# EasyEDA Pro project ProPrj_Final Main_2026-01-12.epro, board PCB2
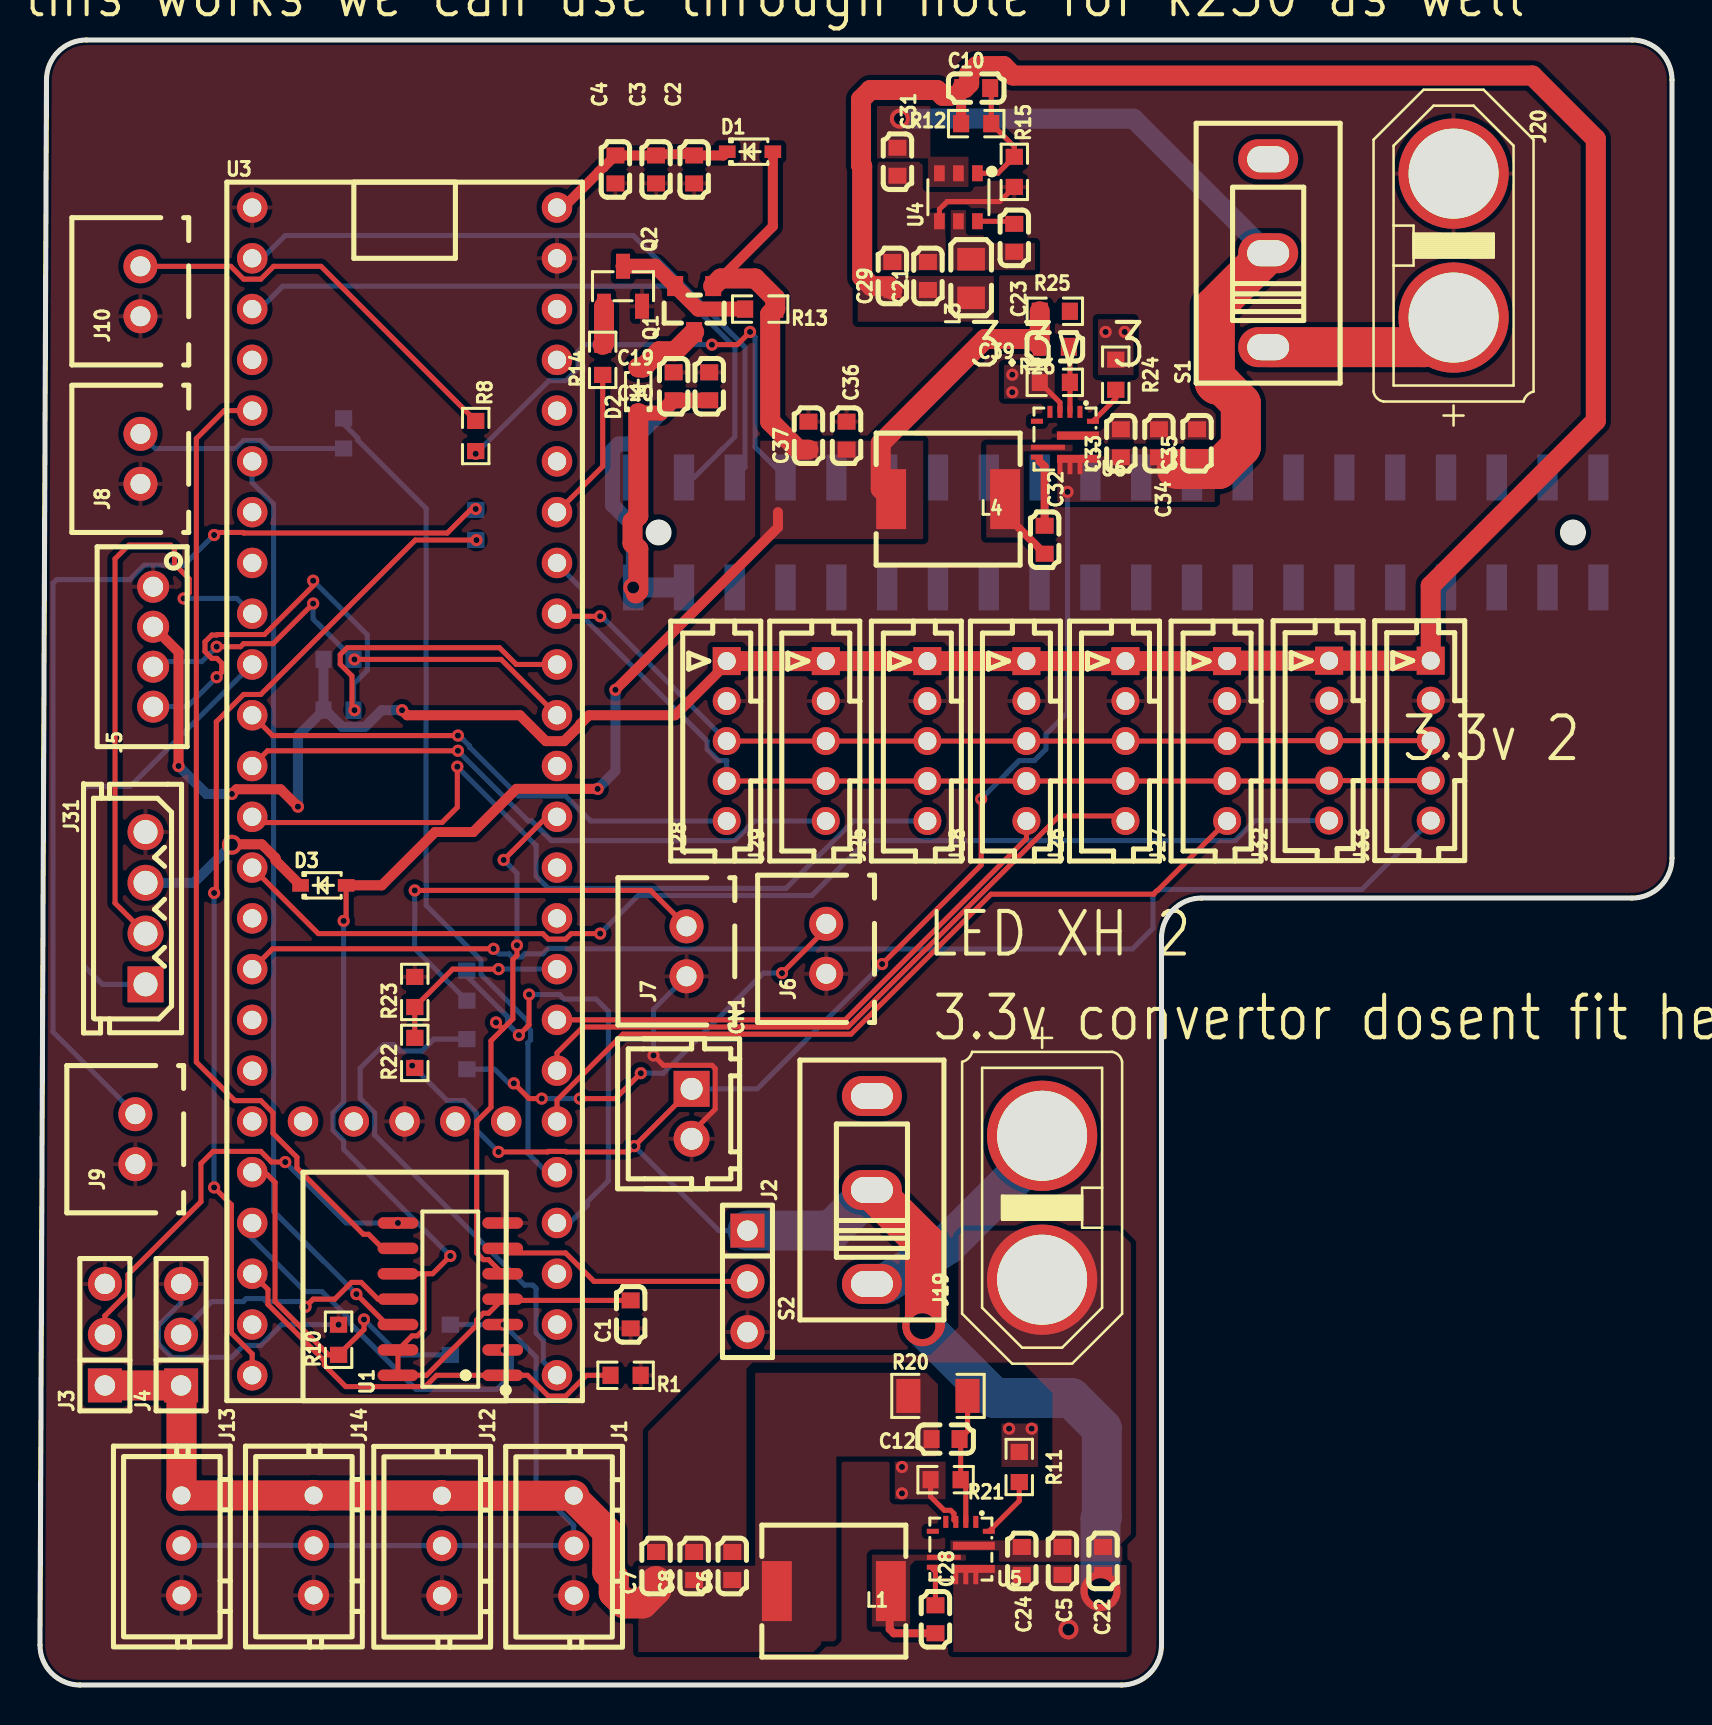
[diagram p1: board, top side]
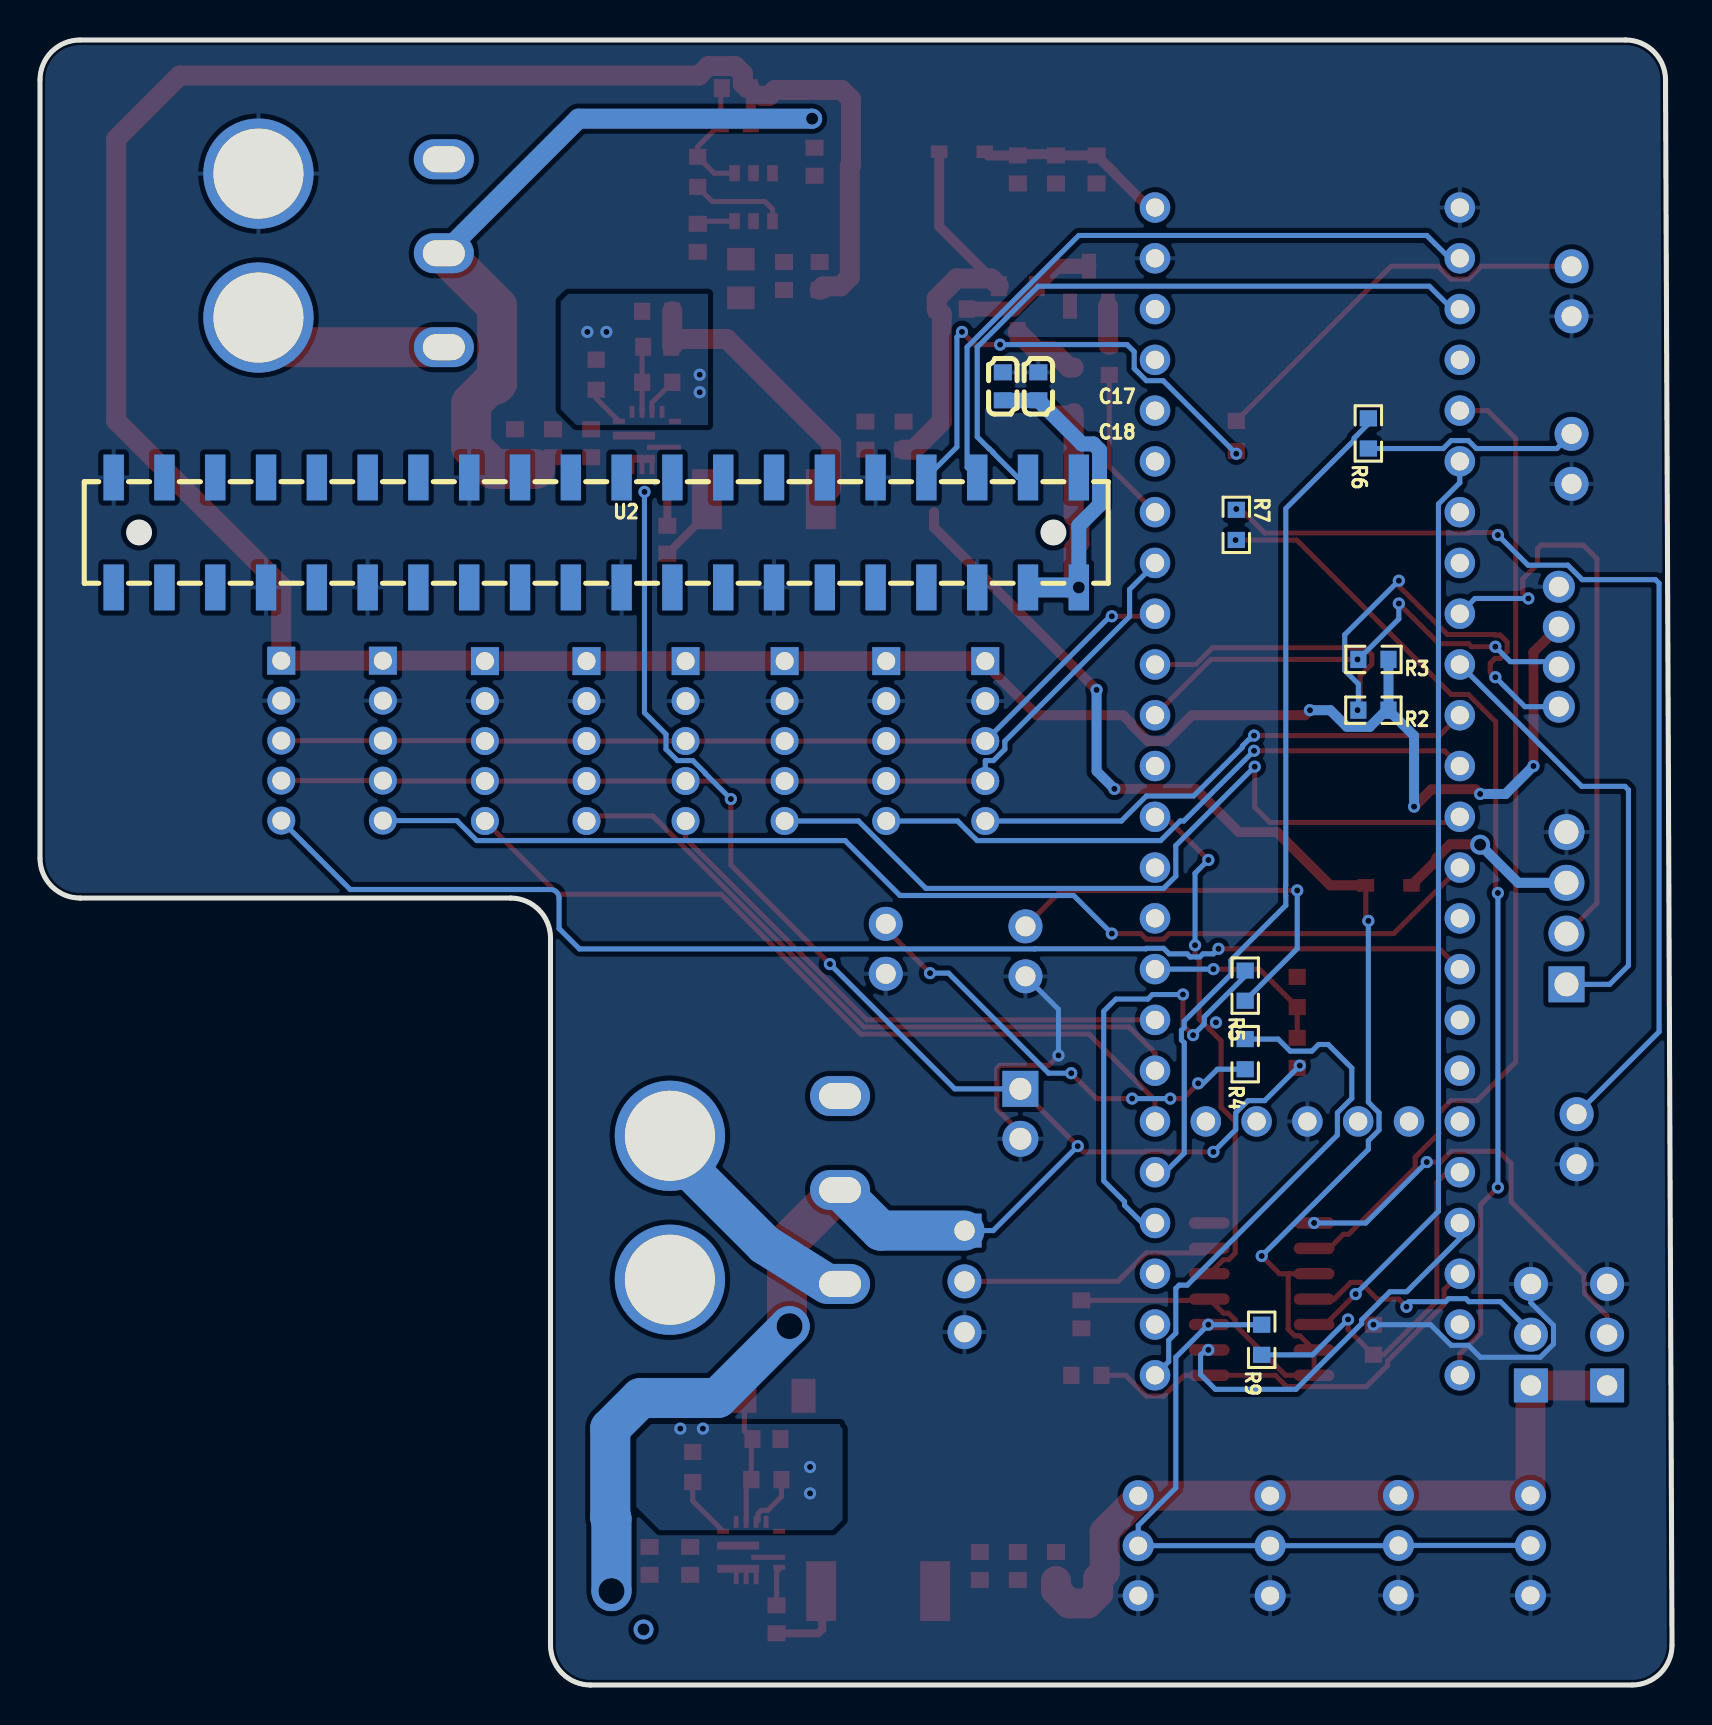
[diagram p2: board, bottom side, seen from below]

Outline 81.6 x 82.3 mm; copper layers: Top Layer, Bottom Layer. Coordinates in mm from the lower left corner of the outline.
Outline path: 0,2.01 0.32,80.3 arc(0.91,81.71) 2.32,82.3 79.6,82.3 arc(81.02,81.71) 81.6,80.3 81.6,41.37 arc(81.02,39.96) 79.6,39.37 58.08,39.37 arc(56.66,38.78) 56.08,37.37 56.08,2 arc(55.49,0.59) 54.08,0 2,0 arc(0.58,0.59) 0,2.01
Stack: Top Layer 0.035mm / Dielectric1 1.51mm FR4 er 4.5 / Bottom Layer 0.035mm

## Design rules (mm)
template: JLCPCB Capability(Two Layers Board)
spacing copperThickness1oz (default): track to track 0.102, other pairs 0.152 to 0.3
spacing copperThickness2oz: track to track 0.203, other pairs 0.152 to 0.3
track width copperThickness1oz (default): min 0.127, default 0.254, max 2.54
track width copperThickness2oz: min 0.203, default 0.254, max 2.54
differential pair differentialPair (default): width min 0.127, default 0.254, max 2.54; gap min 0.152, default 0.152
via viaSize (default): diameter min 0.5, default 0.61, max 10; hole min 0.3, default 0.305, max 6.3

## Placement (name value [footprint] x y rotation side)
C1  100nF  [C0603]  29.53 18.54 90 top
C2  22uF  [C0603]  32.71 75.82 270 top
C3  1uF  [C0603]  30.8 75.82 270 top
C4  100nF  [C0603]  28.77 75.82 270 top
C5  10uF  [C0603]  51.12 6.21 90 top
C6  22uF  [C0603]  34.61 5.95 90 top
C7  22uF  [C0603]  30.8 5.95 90 top
C8  22uF  [C0603]  32.71 5.95 90 top
C10  100pF  [C0603]  46.81 79.89 0 top
C12  150pF  [C0603]  45.28 12.3 0 top
C17  100nF  [C0603]  31.68 64.97 90 bottom
C18  1uF  [C0603]  33.46 64.97 90 bottom
C19  22uF  [C0603]  31.68 64.97 90 top
C20  47uF  [C0603]  33.46 64.97 90 top
C21  22uF  [C0603]  44.4 70.49 90 top
C22  10uF  [C0603]  53.16 6.21 90 top
C23  100nF  [C0603]  48.72 72.4 90 top
C24  100nF  [C0603]  49.09 6.21 90 top
C28  100nF  [C0603]  44.77 3.29 270 top
C29  22uF  [C0603]  42.62 70.49 90 top
C31  10uF  [C0603]  42.88 76.21 270 top
C32  100nF  [C0603]  50.23 57.3 270 top
C33  100nF  [C0603]  54.04 62.12 90 top
C34  10uF  [C0603]  55.95 62.12 90 top
C35  10uF  [C0603]  57.85 62.12 90 top
C36  22uF  [C0603]  40.33 62.5 90 top
C37  22uF  [C0603]  38.42 62.5 90 top
C39  150pF  [C0603]  50.74 66.95 0 top
CN1  ZX-XH2.54-2PZZ  [CONN-TH_2P-P2.50_HX25003-2A]  32.58 28.58 270 top
D1  BAT60B  [SOD-323_L1.7-W1.3-LS2.6-RD-1]  35.5 76.71 0 top
D2  BAT60B  [SOD-323_L1.7-W1.3-LS2.6-RD-1]  29.91 64.77 90 top
D3  BAT60B  [SOD-323_L1.7-W1.3-LS2.6-RD-1]  14.17 40.01 0 top
J1  B3B-XH-A(LF)(SN)  [CONN-TH_3P-P2.50_A2501WV2-3P]  26.69 6.97 270 top
J2  PZ254V-11-03P  [HDR-TH_3P-P2.54-V-M_PZ254V-11-03P]  35.38 20.19 270 top
J3  PZ254V-11-03P  [HDR-TH_3P-P2.54-V-M_PZ254V-11-03P]  3.24 17.53 90 top
J4  PZ254V-11-03P  [HDR-TH_3P-P2.54-V-M_PZ254V-11-03P]  7.05 17.53 90 top
J5  B4B-PH-K-S(LF)(SN)  [CONN-TH_B4B-PH-K-S]  5.66 51.94 90 top
J6  B2B-XH-A(LF)(SN)  [CONN-TH_B2B-XH-A-LF-SN]  39.31 36.83 90 top
J7  B2B-XH-A(LF)(SN)  [CONN-TH_B2B-XH-A-LF-SN]  32.33 36.7 90 top
J8  B2B-XH-A(LF)(SN)  [CONN-TH_B2B-XH-A-LF-SN]  5.02 61.34 90 top
J9  B2B-XH-A(LF)(SN)  [CONN-TH_B2B-XH-A-LF-SN]  4.77 27.31 90 top
J10  B2B-XH-A(LF)(SN)  [CONN-TH_B2B-XH-A-LF-SN]  5.02 69.72 90 top
J12  B3B-XH-A(LF)(SN)  [CONN-TH_3P-P2.50_A2501WV2-3P]  20.09 6.97 270 top
J13  B3B-XH-A(LF)(SN)  [CONN-TH_3P-P2.50_A2501WV2-3P]  7.08 6.98 270 top
J14  B3B-XH-A(LF)(SN)  [CONN-TH_3P-P2.50_A2501WV2-3P]  13.68 6.98 270 top
J18  B5B-PH-K-S(LF)(SN)  [CONN-TH_B5B-PH-K-S-LF-SN]  49.32 47.22 90 top
J19  XT60-F  [CONN-TH_XT60PB-F]  50.11 23.88 90 top
J20  XT60-F  [CONN-TH_XT60PB-F]  70.68 72.01 270 top
J25  B5B-PH-K-S(LF)(SN)  [CONN-TH_B5B-PH-K-S-LF-SN]  44.37 47.22 90 top
J26  B5B-PH-K-S(LF)(SN)  [CONN-TH_B5B-PH-K-S-LF-SN]  54.28 47.22 90 top
J27  B5B-PH-K-S(LF)(SN)  [CONN-TH_B5B-PH-K-S-LF-SN]  59.36 47.22 90 top
J28  B5B-PH-K-S(LF)(SN)  [CONN-TH_B5B-PH-K-S-LF-SN]  34.34 47.22 90 top
J29  B5B-PH-K-S(LF)(SN)  [CONN-TH_B5B-PH-K-S-LF-SN]  39.29 47.22 90 top
J31  22035045  [CONN-TH_22035045]  5.28 38.86 270 top
J32  B5B-PH-K-S(LF)(SN)  [CONN-TH_B5B-PH-K-S-LF-SN]  64.46 47.24 90 top
J33  B5B-PH-K-S(LF)(SN)  [CONN-TH_B5B-PH-K-S-LF-SN]  69.54 47.24 90 top
L1  3.3uH  [IND-SMD_CYA0650-3.3UH]  39.69 4.7 180 top
L3  6.8uH  [L0805]  46.56 70.36 270 top
L4  3.3uH  [IND-SMD_CYA0650-3.3UH]  45.41 59.33 180 top
Q1  AO3401A  [SOT-23_L2.9-W1.3-P1.90-LS2.4-BR]  32.71 68.83 90 top
Q2  SS8050(RANGE:200-350)  [SOT-23-3_L2.9-W1.3-P1.90-LS2.4-BR]  29.15 69.98 270 top
R1  10kΩ  [R0603]  29.28 15.49 180 top
R2  4.7kΩ  [R0603]  14.93 48.77 0 bottom
R3  4.7kΩ  [R0603]  14.93 51.31 0 bottom
R4  470Ω  [R0603]  21.34 31.56 90 bottom
R5  470Ω  [R0603]  21.34 34.99 90 bottom
R6  470Ω  [R0603]  15.18 62.61 90 bottom
R7  470Ω  [R0603]  21.79 58.04 270 bottom
R8  1kΩ  [R0603]  21.79 62.48 270 top
R9  2.2kΩ  [R0603]  20.52 17.27 90 bottom
R10  2.2kΩ  [R0603]  14.93 17.27 90 top
R11  52.3kΩ  [R0603]  48.97 10.91 90 top
R12  196kΩ  [R0603]  46.81 78.11 0 top
R13  1kΩ  [R0603]  36.01 68.83 180 top
R14  1kΩ  [R0603]  28.14 66.29 90 top
R15  62kΩ  [R0603]  48.72 75.7 270 top
R20  90kΩ  [R1206]  44.9 14.46 0 top
R21  10kΩ  [R0603]  45.28 10.27 180 top
R22  80kΩ  [R0603]  18.74 31.62 90 top
R23  20kΩ  [R0603]  18.74 34.67 90 top
R24  52.3kΩ  [R0603]  53.79 65.55 90 top
R25  73.2kΩ  [R0603]  50.74 68.73 0 top
R26  10kΩ  [R0603]  50.74 65.17 180 top
S1  SS-12M11G4  [SW-TH_XKB_SS-12M11XX]  61.41 71.63 90 top
S2  SS-12M11G4  [SW-TH_XKB_SS-12M11XX]  41.6 24.77 90 top
U1  DM74LS126AM  [SOIC-14_L8.7-W3.9-P1.27-LS6.0-BL]  20.52 19.3 90 top
U2  FH-00148  [HDR-SMD_40P-P2.54-V-F-R2-C20-S7.1-EH]  53.79 57.66 0 bottom
U3  -  [TEENSY 4.1]  18.23 43.56 0 top
U4  AP63201WU-7  [TSOT-23-6_L2.9-W1.6-P0.95-LS2.8-BR]  45.92 74.43 90 top
U5  TPS56A37RPAR  [VQFN-HR-10_L3.0-W3.0_TI_RPA]  46.04 6.84 180 top
U6  TPS56A37RPAR  [VQFN-HR-10_L3.0-W3.0_TI_RPA]  51.25 62.38 180 top

## Footprints (pads in the part's own frame, mm; a bottom-side part is the same pattern mirrored in y, then rotated)
C0603
  rect 0.8x0.9 smd: 1(-0.7,0) 2(0.7,0)
CONN-TH_2P-P2.50_HX25003-2A
  rect 1.8x1.8 hole 1.1: 1(-1.25,0)
  round 1.8 hole 1.1: 2(1.25,0)
CONN-TH_3P-P2.50_A2501WV2-3P
  round 1.55 hole 0.9: 1(-2.5,0) 2(0,0) 3(2.5,0)
CONN-TH_22035045
  rect 1.8x1.8 hole 1.2: 1(3.81,0)
  round 1.8 hole 1.2: 2(1.27,0) 3(-1.27,0) 4(-3.81,0)
CONN-TH_B2B-XH-A-LF-SN
  round 1.7 hole 1: 1(1.25,0) 2(-1.25,0)
CONN-TH_B4B-PH-K-S
  round 1.6 hole 1: 1(3,0) 2(1,0) 3(-1,0) 4(-3,0)
CONN-TH_B5B-PH-K-S-LF-SN
  rect 1.4x1.4 hole 0.9: 1(4,0)
  round 1.4 hole 0.9: 2(2,0) 3(0,0) 4(-2,0) 5(-4,0)
CONN-TH_XT60PB-F
  round 5.516 hole 4.505x4.5: +(3.6,0) -(-3.6,0)
HDR-SMD_40P-P2.54-V-F-R2-C20-S7.1-EH
  rect 1.02x2.3 smd: 1(-24.13,-2.75) 2(-24.13,2.75) 3(-21.59,-2.75) 4(-21.59,2.75) 5(-19.05,-2.75) 6(-19.05,2.75) 7(-16.51,-2.75) 8(-16.51,2.75) 9(-13.97,-2.75) 10(-13.97,2.75) 11(-11.43,-2.75) 12(-11.43,2.75) 13(-8.89,-2.75) 14(-8.89,2.75) 15(-6.35,-2.75) 16(-6.35,2.75) 17(-3.81,-2.75) 18(-3.81,2.75) 19(-1.27,-2.75) 20(-1.27,2.75) 21(1.27,-2.75) 22(1.27,2.75) 23(3.81,-2.75) 24(3.81,2.75) 25(6.35,-2.75) 26(6.35,2.75) 27(8.89,-2.75) 28(8.89,2.75) 29(11.43,-2.75) 30(11.43,2.75) 31(13.97,-2.75) 32(13.97,2.75) 33(16.51,-2.75) 34(16.51,2.75) 35(19.05,-2.75) 36(19.05,2.75) 37(21.59,-2.75) 38(21.59,2.75) 39(24.13,-2.75) 40(24.13,2.75)
HDR-TH_3P-P2.54-V-M_PZ254V-11-03P
  rect 1.7x1.7 hole 1.02: 1(-2.54,0)
  round 1.7 hole 1.02: 2(0,0) 3(2.54,0)
IND-SMD_CYA0650-3.3UH
  rect 1.5x3 smd: 1(-2.85,0) 2(2.85,0)
L0805
  rect 1.133x1.377 smd: 1(-0.966,0) 2(0.966,0)
R0603
  rect 0.806x0.864 smd: 1(-0.753,0) 2(0.753,0)
R1206
  rect 1.208x1.701 smd: 1(-1.479,0) 2(1.479,0)
SOD-323_L1.7-W1.3-LS2.6-RD-1
  rect 0.83x0.63 smd: 1(-1.14,0) 2(1.14,0)
SOIC-14_L8.7-W3.9-P1.27-LS6.0-BL
  oval 0.574x2.038 smd: 1(-3.81,-2.619) 2(-2.54,-2.619) 3(-1.27,-2.619) 4(0,-2.619) 5(1.27,-2.619) 6(2.54,-2.619) 7(3.81,-2.619) 8(3.81,2.619) 9(2.54,2.619) 10(1.27,2.619) 11(0,2.619) 12(-1.27,2.619) 13(-2.54,2.619) 14(-3.81,2.619)
SOT-23-3_L2.9-W1.3-P1.90-LS2.4-BR
  rect 1.25x0.7 smd: 1(1,-0.95) 2(1,0.95) 3(-1,0)
SOT-23_L2.9-W1.3-P1.90-LS2.4-BR
  rect 1x0.8 smd: 1(1.15,-0.95) 2(1.15,0.95) 3(-1.15,0)
SW-TH_XKB_SS-12M11XX
  oval 2x3 hole 1.3x2.1: 1(-4.7,0) 2(0,0) 3(4.7,0)
TEENSY 4.1
  round 1.524 hole 0.914: 1(-7.62,30.353) 2(-7.62,27.813) 3(-7.62,25.273) 4(-7.62,22.733) 5(-7.62,20.193) 6(-7.62,17.653) 7(-7.62,15.113) 8(-7.62,12.573) 9(-7.62,10.033) 10(-7.62,7.493) 11(-7.62,4.953) 12(-7.62,2.413) 13(-7.62,-0.127) 14(-7.62,-2.667) 15(-7.62,-5.207) 16(-7.62,-7.747) 17(-7.62,-10.287) 18(-7.62,-12.827) 19(-7.62,-15.367) 20(-7.62,-17.907) 21(-7.62,-20.447) 22(-7.62,-22.987) 23(-7.62,-25.527) 24(-7.62,-28.067) 25(7.62,30.353) 26(7.62,27.813) 27(7.62,25.273) 28(7.62,22.733) 29(7.62,20.193) 30(7.62,17.653) 31(7.62,15.113) 32(7.62,12.573) 33(7.62,10.033) 34(7.62,7.493) 35(7.62,4.953) 36(7.62,2.413) 37(7.62,-0.127) 38(7.62,-2.667) 39(7.62,-5.207) 40(7.62,-7.747) 41(7.62,-10.287) 42(7.62,-12.827) 43(7.62,-15.367) 44(7.62,-17.907) 45(7.62,-20.447) 46(7.62,-22.987) 47(7.62,-25.527) 48(7.62,-28.067) 49(5.08,-15.367) 50(2.54,-15.367) 51(0,-15.367) 52(-2.54,-15.367) 53(-5.08,-15.367)
TSOT-23-6_L2.9-W1.6-P0.95-LS2.8-BR
  rect 0.8x0.532 smd: 1(1.2,-0.95) 2(1.2,0) 3(1.2,0.95) 4(-1.2,0.95) 5(-1.2,0) 6(-1.2,-0.95)
VQFN-HR-10_L3.0-W3.0_TI_RPA
  rect 0.25x0.6 smd: 1(-0.75,-1.317) 2(-0.25,-1.317) 3(0.25,-1.317) 4(0.75,-1.317)
  rect 0.6x0.25 smd: 5(1.4,-0.848) 7(1.4,0.953) 10(-1.4,-0.848)
  rect 1.7x0.25 smd: 6(0.85,0.453)
  custom 2.1x0.97 smd: 8(-0.65,1.317)
  rect 2.1x0.4 smd: 9(-0.65,-0.128)

## Nets
As in the schematic.

Pads without a net: S1 3; S2 3; U2 1 8 10 11 12 13 15 16 17 18 19 21 22 23 24 26 27 28 29 31 32 33 35 36 37 38 40; U3 4 7 8 15 17 18 19 23 27 28 29 30 36 38 39 46 47 49 50 52 53; U5 1 4 5; U6 1 4 5

## Via types
v1: diameter 1, hole 0.6, Top Layer to Bottom Layer, 4 vias
v2: diameter 0.61, hole 0.305, Top Layer to Bottom Layer, 64 vias
v3: diameter 2, hole 1.3, Top Layer to Bottom Layer, 2 vias

## Routing (per net, layer and track width the routed paths; a pad name or vN(x,y) marks a point on that pad's centre or on a via; arc(x,y) is an arc through that point)
+3.3V: length 161.3
  Top Layer w0.5: v2(9.59,44.58) 9.83,44.81 12.03,44.81 v2(12.9,43.94) ; v2(6.93,45.97) 6.93,51.67 J5.2 ; v2(18.1,48.77) 18.36,48.51 24,48.51 25.29,47.22 26.2,47.22 27.01,48.03 27.01,48.08 27.45,48.51 31.76,48.51 34.34,51.1 J28.1 ; R12.1 46.06,79.84
  Top Layer w1: C29.1 42.44,69.97 41.58,69.97 41.11,70.44 41.11,75.98 41.05,76.04 41.05,79.33 41.52,79.79 44.85,79.79 45.14,79.5 45.54,79.5 ; C10.1 46.23,79.89 46.46,80.12 46.46,80.61 46.84,80.99 48.18,80.99 48.65,80.52 74.62,80.52 77.79,77.34 77.79,63.25 69.54,54.99 J33.1 J32.1 59.38,51.24 J27.1 J26.1 J18.1 J25.1 J29.1 J28.1
  Bottom Layer w0.5: v2(9.59,44.58) 8.32,44.58 v2(6.93,45.97) ; R2.1 R3.1 ; R2.1 14.28,48.77 15.11,47.93 16.25,47.93 17.09,48.77 v2(18.1,48.77) ; R2.1 12.9,47.49 12.9,44.2
+5V: length 110.4
  Top Layer w0.254: 19.12,20.57 19.2,20.5 19.2,17.8 18.86,17.47 18.6,17.47 U1.13 U1.14 19.33,15.49 21.84,18.01 21.84,18.27 22.17,18.6 22.43,18.6 U1.4 23.2,19.24 C1.2 ; 19.12,20.57 U1.10 ; 19.12,20.57 19.63,20.57 v2(20.52,21.46) ; v2(15.18,38.23) 15.31,38.35 D3.2
  Top Layer w0.5: 34.04,70.37 36.64,72.97 D1.2 ; v2(28.77,49.78) 36.9,57.91 36.9,58.67 ; v2(27.88,44.83) 23.82,44.83 21.66,42.67 19.75,42.67 17.09,40.01 D3.2
  Top Layer w1: Q1.1 34.04,70.37 35.76,70.37 36.76,69.37 R13.1 36.51,68.58 36.51,63.21 37.92,61.8 C37.1 ; L4.2 42.04,59.85 42.04,62.12 47.26,67.34 49.65,67.34 49.99,67 R25.1
  Bottom Layer w0.254: v2(20.52,21.46) 15.18,26.8 15.18,27.23 14.65,27.76 14.65,28.63 15.18,29.16 v2(15.18,38.23)
  Bottom Layer w0.5: v2(28.77,49.78) 28.77,45.72 v2(27.88,44.83)
+6V: length 37.7
  Top Layer w1.5: 30.8,5.2 30.8,4.75 30.14,4.08 29.22,4.08 28.69,4.61 28.69,5.34 28.37,5.66 28.37,7.67 26.69,9.34 J1.1 J12.1 20.08,9.48 J14.1 J13.1 7.08,14.97 J4.1 J3.1
AGND: length 1.9
  Top Layer w0.254: R26.2 51,64.16 U6.3
  vias: v2(48.62,65.55) v2(48.62,64.67) v2(53.28,67.69) v2(54.24,67.69)
AGND1: length 2.8
  Top Layer w0.254: U5.3 45.7,8.26 45.7,8.58 45.53,8.74 45.22,8.74 44.53,9.43 R21.2
  vias: v2(43.1,10.91) v2(43.1,9.59) v2(48.46,12.83) v2(49.59,12.83)
+BATT: length 135.6
  Top Layer w0.254: v2(42.11,36.07) 47.06,41.02 v2(47.06,44.32) ; CN1.1 v2(29.72,26.96) 29.43,26.67 26.31,26.67 26.28,26.7 25.42,26.7 25.39,26.67 v2(22.93,26.67)
  Top Layer w2: 56.84,60.83 58.93,60.83 60.04,61.95 60.04,64.12 59.1,65.06 58.84,65.06 58.74,65.15 58.74,68.96 S1.2 ; v3(44.12,17.95) 44.25,18.08 44.25,22.11 S2.2
  Bottom Layer w0.254: v2(42.11,36.07) 35.86,29.83 CN1.1 ; v2(29.72,26.96) 33.94,22.73 J2.1 ; v2(22.93,26.67) 21.81,27.79 21.81,28.63 21.2,29.24 20.36,29.24 v2(18.61,30.99) ; v2(51.38,59.69) 51.38,48.64 50.3,47.57 50.3,46.82 49.73,46.24 48.96,46.24 48.34,45.63 48.34,45.61 v2(47.06,44.32)
  Bottom Layer w1: v1(43,78.36) 54.68,78.36 S1.2
  Bottom Layer w2: v3(44.12,17.95) 47.72,14.36 51.57,14.36 53.09,12.84 53.09,8.38 53.03,8.32 v3(53.03,4.7) ; S2.2 39.57,22.73 J2.1
  vias: v1(51.42,2.78)
BATT_READ: length 9.4
  Top Layer w0.254: v2(22.93,35.81) 20.64,35.81 R23.1 R22.2
  Bottom Layer w0.254: U3.40 v2(22.93,35.81)
HS45HB-0_SIGNAL: length 22.1
  Top Layer w0.254: J3.2 3.24,18.47 4.37,19.6 4.37,20.18 4.4,20.21 4.4,20.53 8.05,24.18 8.05,26.09 8.66,26.7 11.04,26.7 11.57,26.16 v2(12.26,26.16)
  Bottom Layer w0.254: v2(17.9,23.11) 15.31,23.11 v2(12.26,26.16)
HS45HB-1_SIGNAL: length 12.8
  Top Layer w0.254: v2(13.28,18.92) 13.66,19.3 14.74,19.3 15.58,20.14 16.06,20.14 16.9,19.3 U1.11
  Bottom Layer w0.254: J4.2 7.05,17.65 8.58,19.18 10.15,19.18 10.31,19.33 11.17,19.33 11.32,19.18 13.15,19.18 13.28,19.05 v2(13.28,18.92)
K230D_PIN_7: length 24.8
  Top Layer w0.254: v2(35.5,67.69) 34.87,67.06 v2(33.6,67.06)
  Bottom Layer w0.254: U2.7 35.76,61.93 35.76,67.44 v2(35.5,67.69) ; v2(21.79,61.6) 25.44,65.25 26.28,65.25 26.89,65.86 26.89,66.7 27.25,67.06 v2(33.6,67.06)
K230RX: length 33.7
  Bottom Layer w0.254: U2.3 32.71,60.41 33.95,61.65 33.95,61.67 34.12,61.84 34.14,61.84 34.74,62.44 34.74,66.93 31.69,69.98 12.13,69.98 10.99,68.83 U3.3
K230TX: length 34.2
  Bottom Layer w0.254: U2.5 35.25,60.92 35.25,66.93 29.66,72.52 12.26,72.52 11.12,71.37 U3.2
KRS3301_SIGNAL: length 12.9
  Top Layer w0.254: J2.2 27.7,20.19 26.28,21.62 23.36,21.62 U1.6
POWER_GND: length 30.2
  Top Layer w0.254: R15.2 47.99,74.21 45.36,74.21 44.97,73.83 U4.4 ; v2(30.68,31.5) 31.17,31 33.6,31 33.76,30.84 33.76,28.81 32.58,27.63 CN1.2
  Bottom Layer w0.254: v2(14.93,18.03) 12.07,18.03 11.04,16.99 10.18,16.99 9.58,16.4 6.59,16.4 5.93,17.06 5.93,17.99 7.05,19.12 J4.3 ; v2(30.68,31.5) 30.68,33.8 J7.2
STS3032_SIGNAL: length 34.8
  Bottom Layer w0.254: R9.2 v2(23.18,18.03) 24.81,16.4 24.81,9.86 26.69,7.98 J1.2 J12.2 13.69,6.97 J14.2 J13.2
TEENSY30: length 21.9
  Top Layer w0.254: U3.22 11.4,19.79 11.4,19.04 14.22,16.22 14.22,16 15.29,14.93 19.26,14.93 19.83,15.49 U1.1 24.38,15.49 25.42,14.45 26.28,14.45 27.32,15.49 R1.2
TEENSY_3: length 49.4
  Top Layer w0.254: U3.5 9.21,63.75 7.82,62.36 7.82,31.16 9.74,29.24 11.04,29.24 11.65,28.63 11.65,27.6 12.85,26.4 12.85,25.87 16.17,22.55 16.43,22.55 17.14,21.84 U1.9
TEENSY_4: length 46.5
  Top Layer w0.254: U1.12 17.34,18.03 v2(15.82,19.56)
  Bottom Layer w0.254: U3.6 10.61,60.15 11.68,59.08 11.68,23.7 v2(15.82,19.56)
TEENSY_9: length 26
  Top Layer w0.254: U3.11 11.63,47.5 v2(20.9,47.5)
  Bottom Layer w0.254: v2(20.9,47.5) 21.08,47.32 21.14,47.32 21.48,46.98 21.48,46.91 23.92,44.48 26.28,44.48 27.53,43.22 J28.5
TEENSY_10: length 31.3
  Top Layer w0.254: v2(20.9,46.74) 11.37,46.74 U3.12
  Bottom Layer w0.254: v2(20.9,46.74) 24.41,43.22 24.59,43.22 25.57,42.24 34.74,42.24 35.72,43.22 J29.5
TEENSY_11: length 41
  Top Layer w0.254: U3.13 10.9,43.15 20.1,43.15 20.87,43.91 v2(20.87,45.94)
  Bottom Layer w0.254: v2(20.87,45.94) 24.81,42 24.81,40.46 25.42,39.85 37.31,39.85 40.67,43.22 J25.5
TEENSY_12: length 57.8
  Top Layer w0.254: v2(28.01,37.59) 26.56,37.59 26.28,37.31 25.42,37.31 25.14,37.59 13.91,37.59 U3.14
  Bottom Layer w0.254: v2(28.01,37.59) 29.91,39.5 38.6,39.5 41.35,42.24 59.76,42.24 60.76,43.24 J32.5
TEENSY_24: length 63.3
  Top Layer w0.254: v2(22.68,36.83) 11.63,36.83 U3.16
  Bottom Layer w0.254: J33.5 66.09,39.8 56.08,39.8 arc(55.78,39.67) 55.65,39.37 55.65,37.85 54.63,36.82 31.86,36.82 31.85,36.83 26.31,36.83 26.28,36.86 25.42,36.86 25.14,36.58 24.24,36.58 24.09,36.42 23.61,36.42 23.45,36.58 22.93,36.58 v2(22.68,36.83)
TEENSY_32: length 50.3
  Top Layer w0.254: v2(21.82,57.28) 18.76,57.28 11.04,49.56 10.18,49.56 8.82,48.19 8.82,39.73 v2(8.71,39.62) ; U3.24 10.61,16.56 9.57,17.6 9.57,24.03 v2(8.71,24.89)
  Bottom Layer w0.254: v2(8.71,24.89) v2(8.71,39.62)
TEENSY_33: length 25.9
  Bottom Layer w0.254: R4.2 19.69,32.31 19.09,31.71 18,31.71 17.67,32.04 17.19,32.04 16.01,30.86 16.01,29.35 16.73,28.63 16.73,27.51 24.24,20 24.64,20 24.81,19.84 24.81,17.6 25.17,17.25 25.17,16.18 U3.48
TEENSY_36: length 22.9
  Top Layer w0.254: v2(23.95,32.51) 24.45,33.02 v2(24.45,34.54)
  Bottom Layer w0.254: R5.2 21.34,35.47 23.39,33.42 23.39,33.07 v2(23.95,32.51) ; v2(24.45,34.54) 25.98,34.54 26.21,34.32 27.81,34.32 28.42,33.71 28.42,25.22 27.38,24.18 27.38,24 26.49,23.11 U3.45
TEENSY_37: length 42.7
  Bottom Layer w0.254: R6.2 15.18,63.09 15.89,62.38 15.89,62.27 19.31,58.86 19.31,40.01 19.32,39.99 19.32,39.51 19.31,39.5 19.31,39 22.05,36.26 22.05,35.55 24.39,33.21 24.39,32.89 24.53,32.75 24.53,32.27 24.39,32.13 24.39,26.61 25.53,25.46 25.66,25.46 U3.44
TEENSY_38: length 40.4
  Top Layer w0.254: U3.43 25.85,29.26 29.15,32.56 40.55,32.56 47.55,39.56 55.7,39.56 arc(55.78,39.67) 55.88,39.75 J27.5
TEENSY_39: length 34.3
  Top Layer w0.254: J26.5 54.02,43.48 50.96,43.48 40.4,32.92 27.15,32.92 25.85,31.62 U3.42
TEENSY_40: length 28.1
  Top Layer w0.254: U3.41 40.26,33.27 49.32,42.34 J18.5
TEENSY_KRS_ENABLE: length 7.8
  Top Layer w0.254: R14.1 28.14,60.96 U3.31
TEENSY_RX2: length 29.4
  Top Layer w0.254: v2(7.18,54.36) 7.46,54.64 7.46,55.34 6.73,56.07 6.73,56.84 6.55,57.02 4.43,57.02 3.75,56.34 3.75,39.12 J31.2
  Bottom Layer w0.254: v2(7.18,54.36) 9.85,54.36 U3.9
TEENSY_SCL-0: length 24.2
  Top Layer w0.254: v2(13.66,54.1) 11.65,52.1 10.18,52.1 10.03,51.94 v2(8.83,51.94) ; v2(15.72,51.31) 23.06,51.31 U3.35
  Bottom Layer w0.254: v2(8.83,51.94) 8.09,51.2 5.91,51.2 J5.3 ; R3.2 13.66,53.33 v2(13.66,54.1)
TEENSY_SCL-1: length 49.9
  Top Layer w0.254: J33.4 J32.4 64.44,45.22 J27.4 J26.4 J18.4 J25.4 J29.4 J28.4
  Bottom Layer w0.254: U3.32 26.1,55.88 26.1,55.83 27.12,54.81 27.12,53.46 33.36,47.22 33.36,46.82 33.93,46.24 34.33,46.24 34.34,46.24 J28.4
TEENSY_SDA-0: length 35.3
  Top Layer w0.254: U3.34 23.81,51.05 22.98,51.89 15.35,51.89 15.01,51.55 15.01,51.07 15.6,50.48 15.6,48.9 v2(15.72,48.77) ; v2(13.66,55.25) 13.66,54.99 11.23,52.55 8.87,52.55 8.84,52.53 8.59,52.53 8.25,52.19 8.25,51.7 8.59,51.36 8.84,51.36 9.09,51.12 9.09,50.67 v2(8.83,50.42)
  Bottom Layer w0.254: v2(8.83,50.42) 7.36,48.94 J5.4 ; v2(13.66,55.25) 16.36,52.54 16.36,50.76 15.68,50.08 R2.2
TEENSY_SDA-1: length 46.3
  Top Layer w0.254: J28.3 J29.3 J25.3 J18.3 J26.3 J27.3 59.38,47.24 J32.3 J33.3 ; v2(28.01,53.47) 25.98,53.47 U3.33
  Bottom Layer w0.254: J28.3 28.09,53.47 v2(28.01,53.47)
TEENSY_TX2: length 23.3
  Bottom Layer w0.254: U3.10 4.51,44.96 2.36,44.96 2.18,44.78 2.18,35.99 3.12,35.05 J31.1
TEENSY_TX3: length 26.5
  Top Layer w0.254: U1.5 22.43,21.28 22.17,21.28 21.84,21.61 21.84,28.19 22.55,28.9 22.55,32.23 23.14,32.81 ; 23.14,32.81 23.64,33.32 23.64,36.3 23.85,36.5 v2(23.85,37.01) ; 23.14,32.81 v2(22.8,33.15) ; v2(23.18,41.28) 25.34,43.43 U3.37
  Bottom Layer w0.254: v2(23.18,41.28) 23.85,40.61 v2(23.85,37.01)
TEENSYRX7: length 18.9
  Top Layer w0.254: U3.20 10.74,25.53 11.37,25.53 11.75,25.15 11.75,19.19 14.42,16.52 R10.1 16.2,17.79 v2(16.2,18.29)
  Bottom Layer w0.254: R9.1 17.97,16.52 v2(16.2,18.29)
TEENSYTX7: length 18.9
  Bottom Layer w0.254: v2(23.18,16.76) 23.31,16.76 23.57,16.5 23.57,15.53 22.83,14.79 18.81,14.79 15.51,18.09 15.51,18.27 14.11,19.67 13.27,19.67 10.48,22.46 10.48,22.99 U3.21
$1N12: length 6.1
  Top Layer w0.254: 47.51,79.89 47.56,79.84 R12.2 48.72,76.96 R15.1 47.89,75.63 U4.1
$1N18: length 9.9
  Top Layer w2: 70.68,68.41 69.2,66.93 S1.1
$1N25: length 4.3
  Top Layer w0.4: C28.2 42.69,2.59 42.49,2.79 42.49,4.64 L1.1
$1N32: length 3.1
  Top Layer w0.254: U5.10 48.97,9.21 R11.1
$1N56: length 1.9
  Top Layer w0.254: 44.64,5.8 44.77,5.67 C28.1
$1N84: length 6.6
  Top Layer w0.254: U5.2 46.29,10.01 R21.1 46.04,12.25 C12.2 46.38,12.7 R20.2
$1N113: length 1.9
  Top Layer w0.254: C23.2 48.58,73.23 U4.6
$1N12525: length 9.7
  Top Layer w0.5: D1.1 34.17,76.52 C2.1 32.65,76.58 30.87,76.58 C3.1 C4.1 28.17,75.92 28.16,75.92 27.92,75.69 27.92,75.67 26.17,73.91 U3.25
$1N12541: length 28.8
  Top Layer w0.75: C20.1 C19.1 31.04,63.63 D2.1
  Top Layer w1: D2.1 29.91,58.48 29.63,58.2 29.63,57.12 29.91,56.83 29.91,54.74 29.79,54.61
  Bottom Layer w0.75: v1(29.66,54.91) 29.66,58 28.62,59.04 28.62,61.78 28.93,62.09 29.5,62.09 C19.1 C20.1
  Bottom Layer w1: v1(29.66,54.91) U2.4
$1N12578: length 2
  Top Layer w1: R14.2 28.2,67.11 Q2.1
$1N12583: length 7
  Top Layer w0.75: Q2.3 30.77,70.98 Q1.2 32.91,68.83 R13.2
$1N12598: length 20.5
  Top Layer w0.254: R8.1 14.05,70.97 11.68,70.97 11.04,70.33 10.18,70.33 9.54,70.97 J10.1
$1N12604: length 10.8
  Bottom Layer w0.254: R6.1 11.44,61.86 11.04,62.26 10.18,62.26 9.78,61.86 5.76,61.86 J8.1
$1N12618: length 22.3
  Top Layer w0.254: J6.1 39.31,37.83 v2(37.1,35.61) ; v2(30.04,30.61) 28.77,29.34 v2(26.99,29.34) ; v2(23.69,30.1) 24.45,29.34 v2(25.09,29.34)
  Bottom Layer w0.254: 23.56,29.97 22.73,30.81 R4.1 ; v2(37.1,35.61) 36.18,35.61 31.17,30.61 v2(30.04,30.61) ; v2(25.09,29.34) v2(26.99,29.34)
$1N12632: length 51
  Top Layer w0.254: v2(8.71,57.53) 8.83,57.66 10.15,57.66 10.18,57.63 20.36,57.63 21.66,58.93 21.79,58.93
  Bottom Layer w0.254: v2(8.71,57.53) 7.2,56.02 5.21,56.02 4.49,55.3 0.83,55.3 0.65,55.12 0.65,32.68 J9.1
  vias: v2(21.79,58.83)
$1N12638: length 20.9
  Top Layer w0.254: J7.1 30.53,39.75 v2(18.74,39.75)
  Bottom Layer w0.254: R5.1 18.74,36.84 v2(18.74,39.75)
$1N12659: length 9.5
  Top Layer w0.5: v1(9.59,42.04) 9.62,42.06 11.09,42.06 11.77,41.38 11.77,41.26 D3.1
  Bottom Layer w0.5: J31.3 7.69,40.13 v1(9.59,42.04)
$1N12737: length 3.5
  Top Layer w1: D2.2 30.15,65.91 30.96,66.72 31.75,66.72 Q1.3
$1N14648: length 11.4
  Bottom Layer w2: 42.23,20.07 45.35,22.03 50.33,27 50.33,27.26 J19.+ ; 41.73,20.07 S2.1
$1N16477: length 3.6
  Top Layer w0.4: L4.1 48.26,58.57 C32.2
$1N16482: length 2
  Top Layer w0.254: 52.65,63.22 53.79,64.36 R24.1
$1N16489: length 3.3
  Top Layer w0.4: C32.1 50.23,60.96 49.97,61.22
$1N16497: length 3.3
  Top Layer w0.254: U6.2 51.5,65.16 R26.1 51.5,66.89 C39.2

## Copper pours and planes (outline as drawn; the poured copper is in the pictures)
+3.3V on Top Layer: 40.89,70.49 47.69,70.49 47.69,68.2 40.89,68.2
+5V on Top Layer: 36.01,62.25 44.16,62.25 44.16,57.33 36.01,57.33
+6V on Top Layer: 29.91,6.43 39.06,6.43 39.06,1.65 29.91,1.65
+6V on Top Layer: 35.76,15.62 45.03,15.62 45.03,2.18 35.76,2.18
AGND on Top Layer: 48.2,66.04 50.74,66.04 50.74,64.35 48.2,64.35
AGND on Top Layer: 52.9,68.33 54.68,68.33 54.68,65.53 52.9,65.53
AGND on Bottom Layer: 48.2,69.6 55.57,69.6 55.57,63.03 48.2,63.03
AGND1 on Top Layer: 48.08,13.08 49.91,13.08 49.91,10.91 48.08,10.91
AGND1 on Top Layer: 42.74,11.18 45.28,11.18 45.28,9.3 42.74,9.3
AGND1 on Bottom Layer: 41.47,13.06 51.79,13.06 51.79,7.75 41.47,7.75
+BATT on Top Layer: 41.85,78.99 44.52,78.99 44.52,76.37 41.85,76.37
+BATT on Top Layer: 45.66,6.01 54.33,6.01 54.33,1.65 45.66,1.65
+BATT on Top Layer: 44.4,76.45 46.42,76.45 46.42,74.94 44.4,74.94
+BATT on Top Layer: 53.33,61.84 58.74,61.84 58.74,60.73 53.33,60.73
+BATT on Top Layer: 50.87,61.47 58.74,61.47 58.74,59.18 50.87,59.18
MGND on Top Layer: 45.52,7.24 54.12,7.24 54.12,6.17 45.52,6.17
MGND on Top Layer: 30.4,22.73 54.55,22.73 54.55,6.25 30.4,6.25
POWER_GND on Top Layer: -0.06,82.55 82.37,82.55 82.37,-0.76 -0.06,-0.76
POWER_GND on Top Layer: 41.91,76.21 45.27,76.21 45.27,70.77 41.91,70.77
POWER_GND on Top Layer: 50.83,63.63 58.74,63.63 58.74,62.3 50.83,62.3
POWER_GND on Bottom Layer: -0.06,83.06 82.62,83.06 82.62,-0.76 -0.06,-0.76
$1N25 on Top Layer: 41.6,6.52 46.3,6.52 46.3,2.92 41.6,2.92
$1N29 on Top Layer: 45.54,73.79 49.75,73.79 49.75,70.79 45.54,70.79
$1N16477 on Top Layer: 47.31,62.05 51.63,62.05 51.63,57.4 47.31,57.4

Small or netless copper shapes (teardrops, artwork), in the pictures only: 1 on Top Layer

## Text on the board
Top Silkscreen Layer: if this works we can use through hole for k230 as well | XT60 connector we order would be like this / https://www.amazon.ca/RIIEYOCA-Connector-Extension-Quadcopter-XT60-male/dp/B09L62W679/ref=asc_df_B09L62W679?mcid=5ea187ce5ddb3fdd8b7d2b90c9799982&tag=googleshopc0c-20&linkCode=df0&hvadid=706743214245&hvpos=&hvnetw=g&hvrand=18416964478274017855&hvpone=&hvptwo=&hvqmt=&hvdev=c&hvdvcmdl=&hvlocint=&hvlocphy=9191846&hvtargid=pla-1730363463987&hvocijid=18416964478274017855-B09L62W679-&hvexpln=0&gad_source=1&th=1 | J5 -> XH / J6~J10 -> XH 2pin, and you can utilize bottom layer as well / lets try to follow the regulator pcb design as close to instructed | LED XH 2 | 3.3v convertor dosent fit here then place at 2 or 3 | 3.3v 3 | 3.3v 2
